# EAGLE design Reaccion-vRegvB (EAGLE 7.4.0)
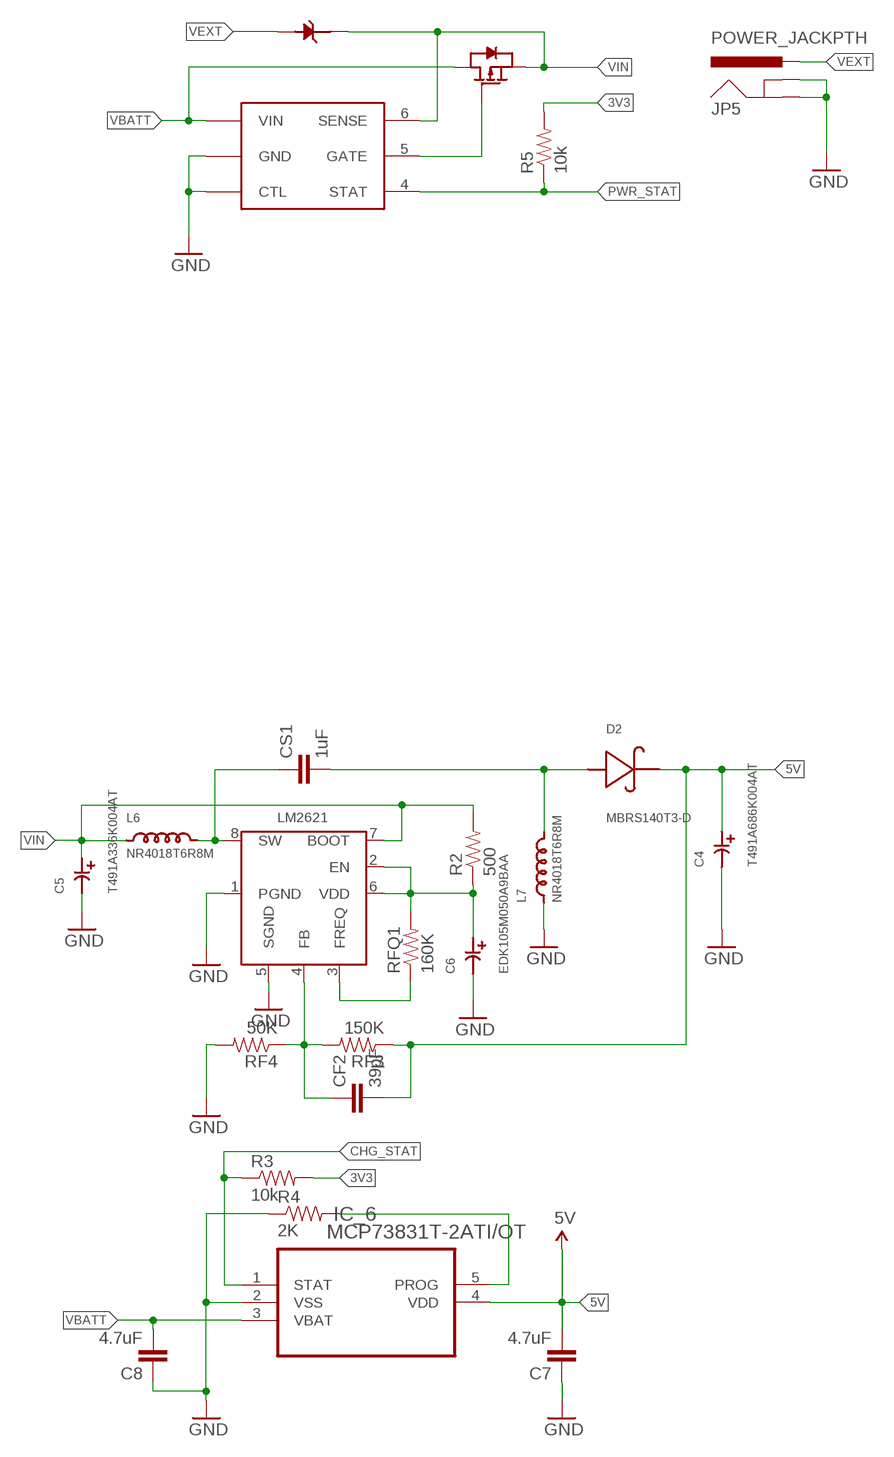
[diagram p0: schematic, sheet 1]

## Parts
C4  T491A686K004AT  [3216-18]
C5  T491A336K004AT  [3216-18]
C6  EDK105M050A9BAA  [EDK105M050A9BAA]
C7  4.7uF  CAP0805  [0805]
C8  4.7uF  CAP0805  [0805]
CF2  39pF  CAP0805  [0805]
CS1  1uF  CAP0805  [0805]
D2  MBRS140T3-D  [MBRS140T3G]
D4  1N5819HW-7-F  [SOD123]
IC_1  LTC4412  [SOT23-6L]
IC_4  LM2621  [R-PDSO-G8]
IC_6  MCP73831T-2ATI/OT  [SOT95P300X145-5N]
JP5  POWER_JACKPTH  [POWER_JACK_PTH]
L6  NR4018T6R8M  [NR4018/NRS4018]
L7  NR4018T6R8M  [NR4018/NRS4018]
Q9  SI2301CDS  [SOT23]
R2  500  RESISTOR0805-RES  [0805]
R3  10k  RESISTOR0805-RES  [0805]
R4  2K  RESISTOR0805-RES  [0805]
R5  10k  RESISTOR0805-RES  [0805]
RF3  150K  RESISTOR0805-RES  [0805]
RF4  50K  RESISTOR0805-RES  [0805]
RFQ1  160K  RESISTOR0805-RES  [0805]

## Nets
3V3: R3.2 R5.2
5V: C4.1 C7.2 CF2.2 D2.2 IC_6.4(VDD) RF3.1
CHG_STAT: IC_6.1(STAT) R3.1
GND: C4.2 C5.2 C6.P$2 C7.1 C8.1 IC_1.2(GND) IC_1.3(CTL) IC_4.1(PGND) IC_4.5(SGND) IC_6.2(VSS) JP5.GND JP5.GNDBREAK L7.P$1 R4.1 RF4.2
N$2: CS1.1 IC_4.8(SW) L6.P$2
N$6: C6.P$1 IC_4.2(EN) IC_4.6(VDD) R2.1 RFQ1.2
N$8: IC_4.3(FREQ) RFQ1.1
N$9: CF2.1 IC_4.4(FB) RF3.2 RF4.1
N$10: CS1.2 D2.1 L7.P$2
N$11: IC_6.5(PROG) R4.2
N$12: IC_1.5(GATE) Q9.1(GATE)
PWR_STAT: IC_1.4(STAT) R5.1
VBATT: C8.2 IC_1.1(VIN) IC_6.3(VBAT) Q9.3(DRAIN)
VEXT: D4.2(ANODE) JP5.PWR
VIN: C5.1 D4.1(CATHODE) IC_1.6(SENSE) IC_4.7(BOOT) L6.P$1 Q9.2(SOURCE) R2.2

## Library data of the parts
C4 = custom_componentsv0.9:T491A686K004AT
C5 = custom_componentsv0.9:T491A336K004AT
C6 = custom_componentsv0.9:EDK105M050A9BAA
C7 C8 CF2 CS1 = SparkFun-Capacitors:CAP: Capacitor Standard 0603 ceramic capacitor, and 0.1" leaded capacitor.
D2 = custom_componentsv0.9:MBRS140T3-D
D4 = custom_components:1N5819HW-7-F
IC_1 = custom_components:LTC4412
IC_4 = custom_componentsv0.9:LM2621
IC_6 = custom_components:MCP73831T-2ATI/OT: IC, BATT CHARGER, Li-Ion Li-Polymer, 500 mA; MPN: MCP73831T-2ATI/OT; OC_FARNELL: 1834890; OC_NEWARK: 84R5196; PACKAGE: SOT23-5; SUPPLIER: Microchip
JP5 = SparkFun-Connectors:POWER_JACK: Power Jack This is the standard 5.5mm barrel jack for power. The PTH is the most common, proven, reliable, footprint. The Slot footprint only works if the mill layer is transmitted to the PCB fab house so be warned. Mating wall wart : TOL-00298 (and others); PROD_ID: CONN-08197
L6 L7 = custom_componentsv0.9:NR4018T6R8M
Q9 = custom_components:SI2301CDS
R2-R5 RF3 RF4 RFQ1 = SparkFun-Resistors:RESISTOR: Resistor Basic schematic elements and footprints for 0603, 1206, and PTH resistors.

## Net classes
0 default: clearance 0.205 mm

## Board
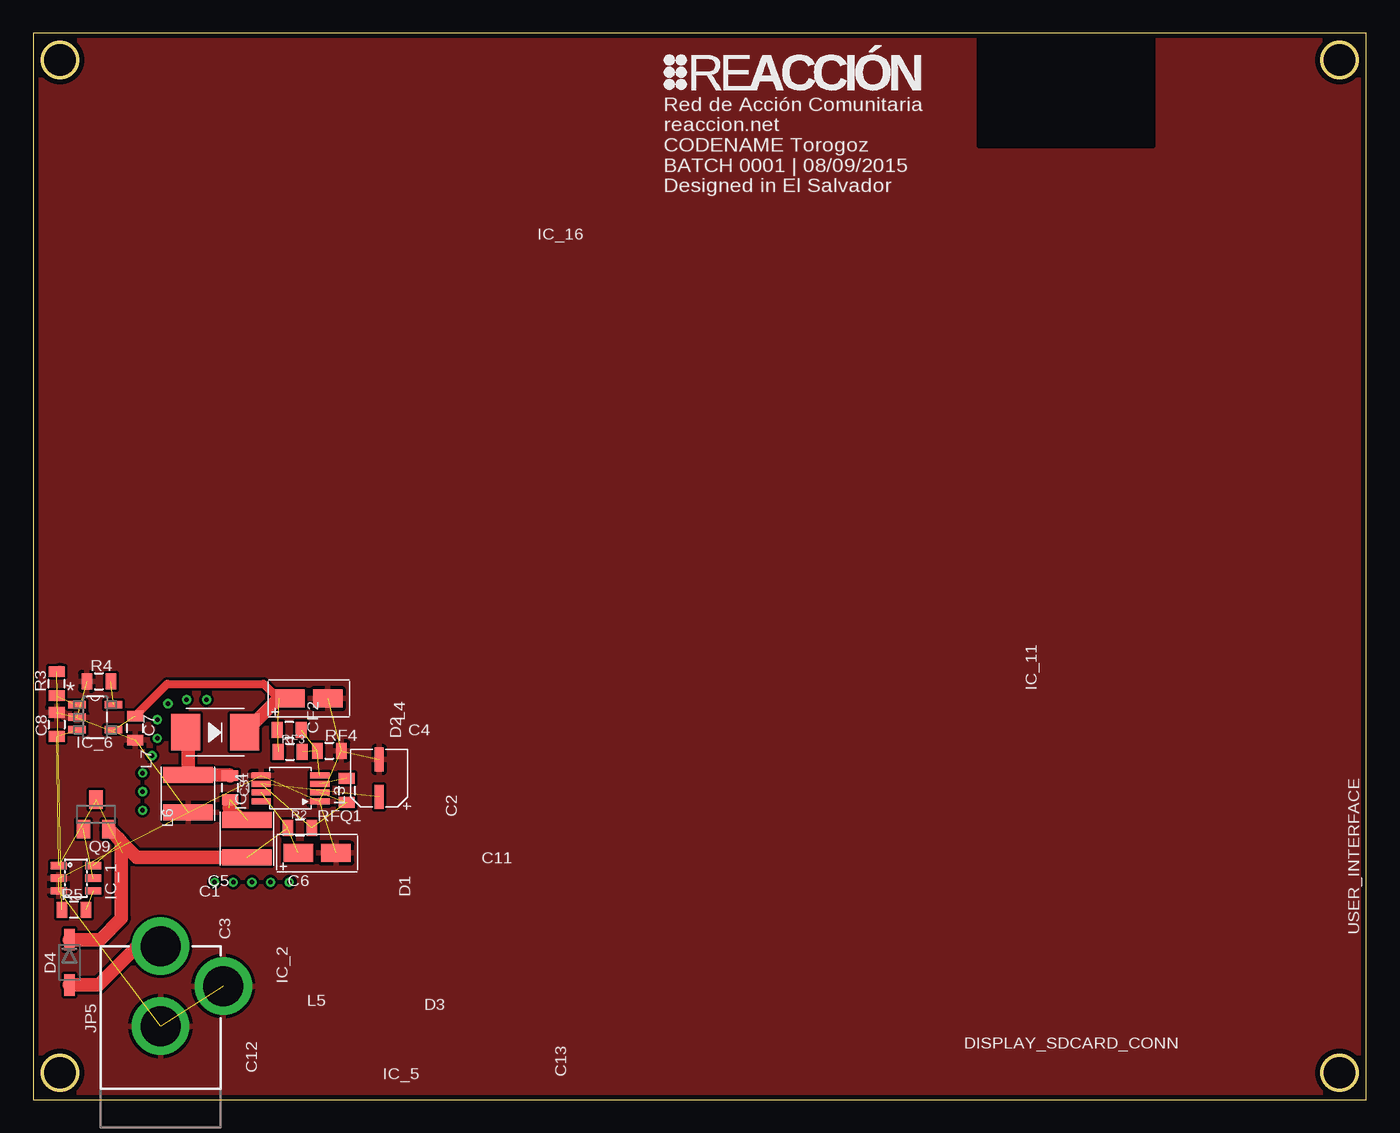
[diagram p1: board, top side]
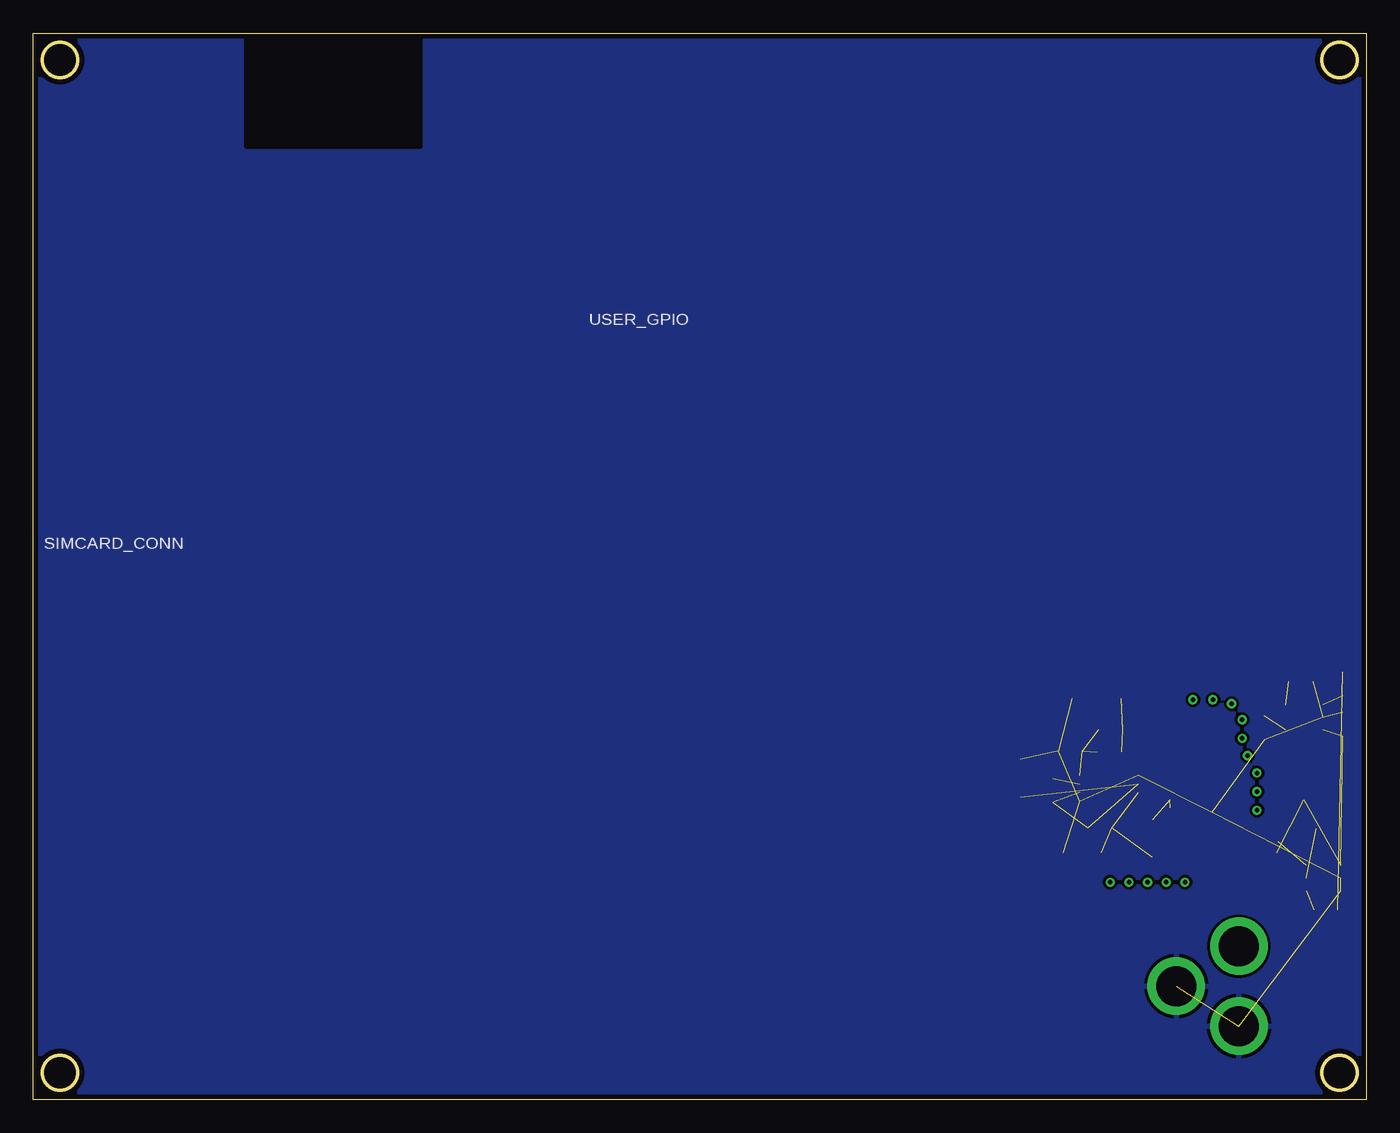
[diagram p2: board, bottom side, seen from below]

Size 100 x 80 mm. Coordinates in mm from the lower left corner, seen from the top.
Outline: 0,0 100,0 100,80 0,80 0,0
Outline: circle at 2,78 radius 1.3
Outline: circle at 98,78 radius 1.3
Outline: circle at 98,2 radius 1.3
Outline: circle at 2,2 radius 1.3
Copper layers (1*16): Top 0.0356mm / dielectric 1.5011mm / Bottom 0.0356mm
Design rules "LaenPCBOrder": minimum track width 6mil, minimum drill 13mil, track to track 6mil, track to pad 6mil, pad to pad 6mil, via to via 6mil, smd to smd 6mil, copper to edge 15mil, drill to drill 6mil, minimum pad ring 7mil, minimum via ring 7mil, stop-mask expansion 3mil, vias tented up to drill 0mil, thermal gap 10mil
tRestrict: area 71,71.6 to 84,80
bRestrict: area 71,71.5 to 84,80

### Footprints (pad centres in the part's own frame; a part is rotated, then mirrored left to right if it is on the bottom)
3216-18 = smd 2.2 x 1.35: 1 1.41,0; 2 -1.41,0
EDK105M050A9BAA = smd 1.8 x 0.65: P$1 1.4,0; P$2 -1.4,0
0805 = smd 0.8 x 1.2: 1 -0.9,0; 2 0.9,0
MBRS140T3G = smd 2.159 x 2.743: 1 2.21,0; 2 -2.21,0
SOD123 = smd 1.6 x 0.8: 1 -1.7,0; 2 1.7,0
SOT23-6L = smd 0.55 x 1.2: 1 -0.95,-1.3; 2 0,-1.3; 3 0.95,-1.3; 4 0.95,1.3; 5 0,1.3; 6 -0.95,1.3
R-PDSO-G8 = smd 0.45 x 1.45: 1 -0.975,-2.2; 2 -0.325,-2.2; 3 0.325,-2.2; 4 0.975,-2.2; 5 0.975,2.2; 6 0.325,2.2; 7 -0.325,2.2; 8 -0.975,2.2
SOT95P300X145-5N = smd 1.321 x 0.559: 1 -1.372,0.94; 2 -1.372,0; 3 -1.372,-0.94; 4 1.372,-0.94; 5 1.372,0.94
POWER_JACK_PTH = drill 2.997 pad 4.318: GND 0,7.7; GNDBREAK 4.7,10.7; PWR 0,13.7
NR4018/NRS4018 = smd 1.2 x 3.7: P$1 -1.4,0; P$2 1.4,0
SOT23 = smd 1 x 1.4: 1 -0.95,-1.1; 2 0.95,-1.1; 3 0,1.1

### Placement (x,y rotation side)
C4  20.68,30.09 180 top
C5  21.3,18.5 180 top
C6  25.94,24.11 270 top
C7  7.63,27.87 90 top
C8  1.75,28.14 270 top
CF2  19.2,27.72 180 top
CS1  14.75,23.39 90 top
D2  13.64,27.55 180 top
D4  2.7,10.3 270 top
IC_1  3.2,16.6 270 top
IC_4  19.29,23.36 90 top
IC_6  4.64,28.68 0 top
JP5  9.55,-2.19 0 top
L6  16.03,19.58 90 top
L7  11.6,22.95 90 top
Q9  4.7,21.4 0 top
R2  20,20.39 180 top
R3  1.75,31.2 90 top
R4  4.92,31.37 0 top
R5  3.05,14.25 180 top
RF3  19.27,26.09 0 top
RF4  22.21,26.16 0 top
RFQ1  23.51,23.19 270 top

### Tracks (layer width: path | path; a pad name or v marks a point on that pad's centre or on a via)
3V3  (1 unrouted)
  Top 0.61: 2,32.27 R3.2
5V  (3 unrouted)
  Top 0.61: C7.2 10.06,31.2 17.28,31.2 18.39,30.09
  Top 1.016: D2.2 18.39,30.09 C4.1
CHG_STAT  (1 unrouted)
GND  (14 unrouted)
  pour Top: 0,0 99.95,0 99.95,79.94 0,79.94
  pour Bottom: 0,0 100.19,0 100.19,80.03 0.13,80.03
N$1  (via drill 0.33)
  other vias: 8.2,21.7
N$2  (2 unrouted)
  Top 0.254: IC_4.8 16.88,22.35
  Top 1.016: L6.P$2 15.62,20.98 14.7,21.9
N$3  (via drill 0.33)
  other vias: 8.2,23.1
N$4  (via drill 0.33)
  other vias: 8.2,24.5
N$5  (via drill 0.33)
  other vias: 8.9,25.8
N$6  (4 unrouted)
N$7  (via drill 0.33)
  other vias: 9.3,27.1
N$8  (1 unrouted)
N$9  (3 unrouted)
N$10
  Top 1.016: CS1.2 14.69,24.35 L7.P$2 11.6,27.38 D2.1
N$11  (1 unrouted)
N$12  (1 unrouted)
N$13  (via drill 0.33)
  other vias: 9.3,28.5
N$14  (via drill 0.33)
  other vias: 10.1,29.7
N$15  (via drill 0.33)
  other vias: 11.5,30
N$16  (via drill 0.33)
  other vias: 13,30
N$17  (via drill 0.33)
  other vias: 13.6,16.3
N$18  (via drill 0.33)
  other vias: 15,16.3
N$19  (via drill 0.33)
  other vias: 16.4,16.3
N$20  (via drill 0.33)
  other vias: 17.8,16.3
N$21  (via drill 0.33)
  other vias: 19.2,16.3
PWR_STAT  (1 unrouted)
VBATT  (4 unrouted)
VEXT
  Top 1.016: D4.2 4.9,8.6 7.8,11.5 JP5.PWR
VIN  (4 unrouted)
  Top 1.016: D4.1 5,12 6.6,13.6 6.6,19.35 | 6.6,19.35 6.28,19.68 Q9.2 | L6.P$1 7.77,18.18 6.6,19.35

### Text on the board
tNames: Red de Acción Comunitaria / reaccion.net / CODENAME Torogoz / BATCH 0001 | 08/09/2015 / Designed in El Salvador | IC_16 | IC_11 | D2 | L4 | C4 | L7 | IC_4 | L3 | C2 | L6 | C11 | C5 | C6 | C1 | D1 | C3 | USER_INTERFACE | IC_2 | L5 | D3 | DISPLAY_SDCARD_CONN | C12 | IC_5 | C13
bNames: USER_GPIO | SIMCARD_CONN